# EasyEDA Pro project EPass_New.eprj

# Schematic Schematic1
Board Name: Board1
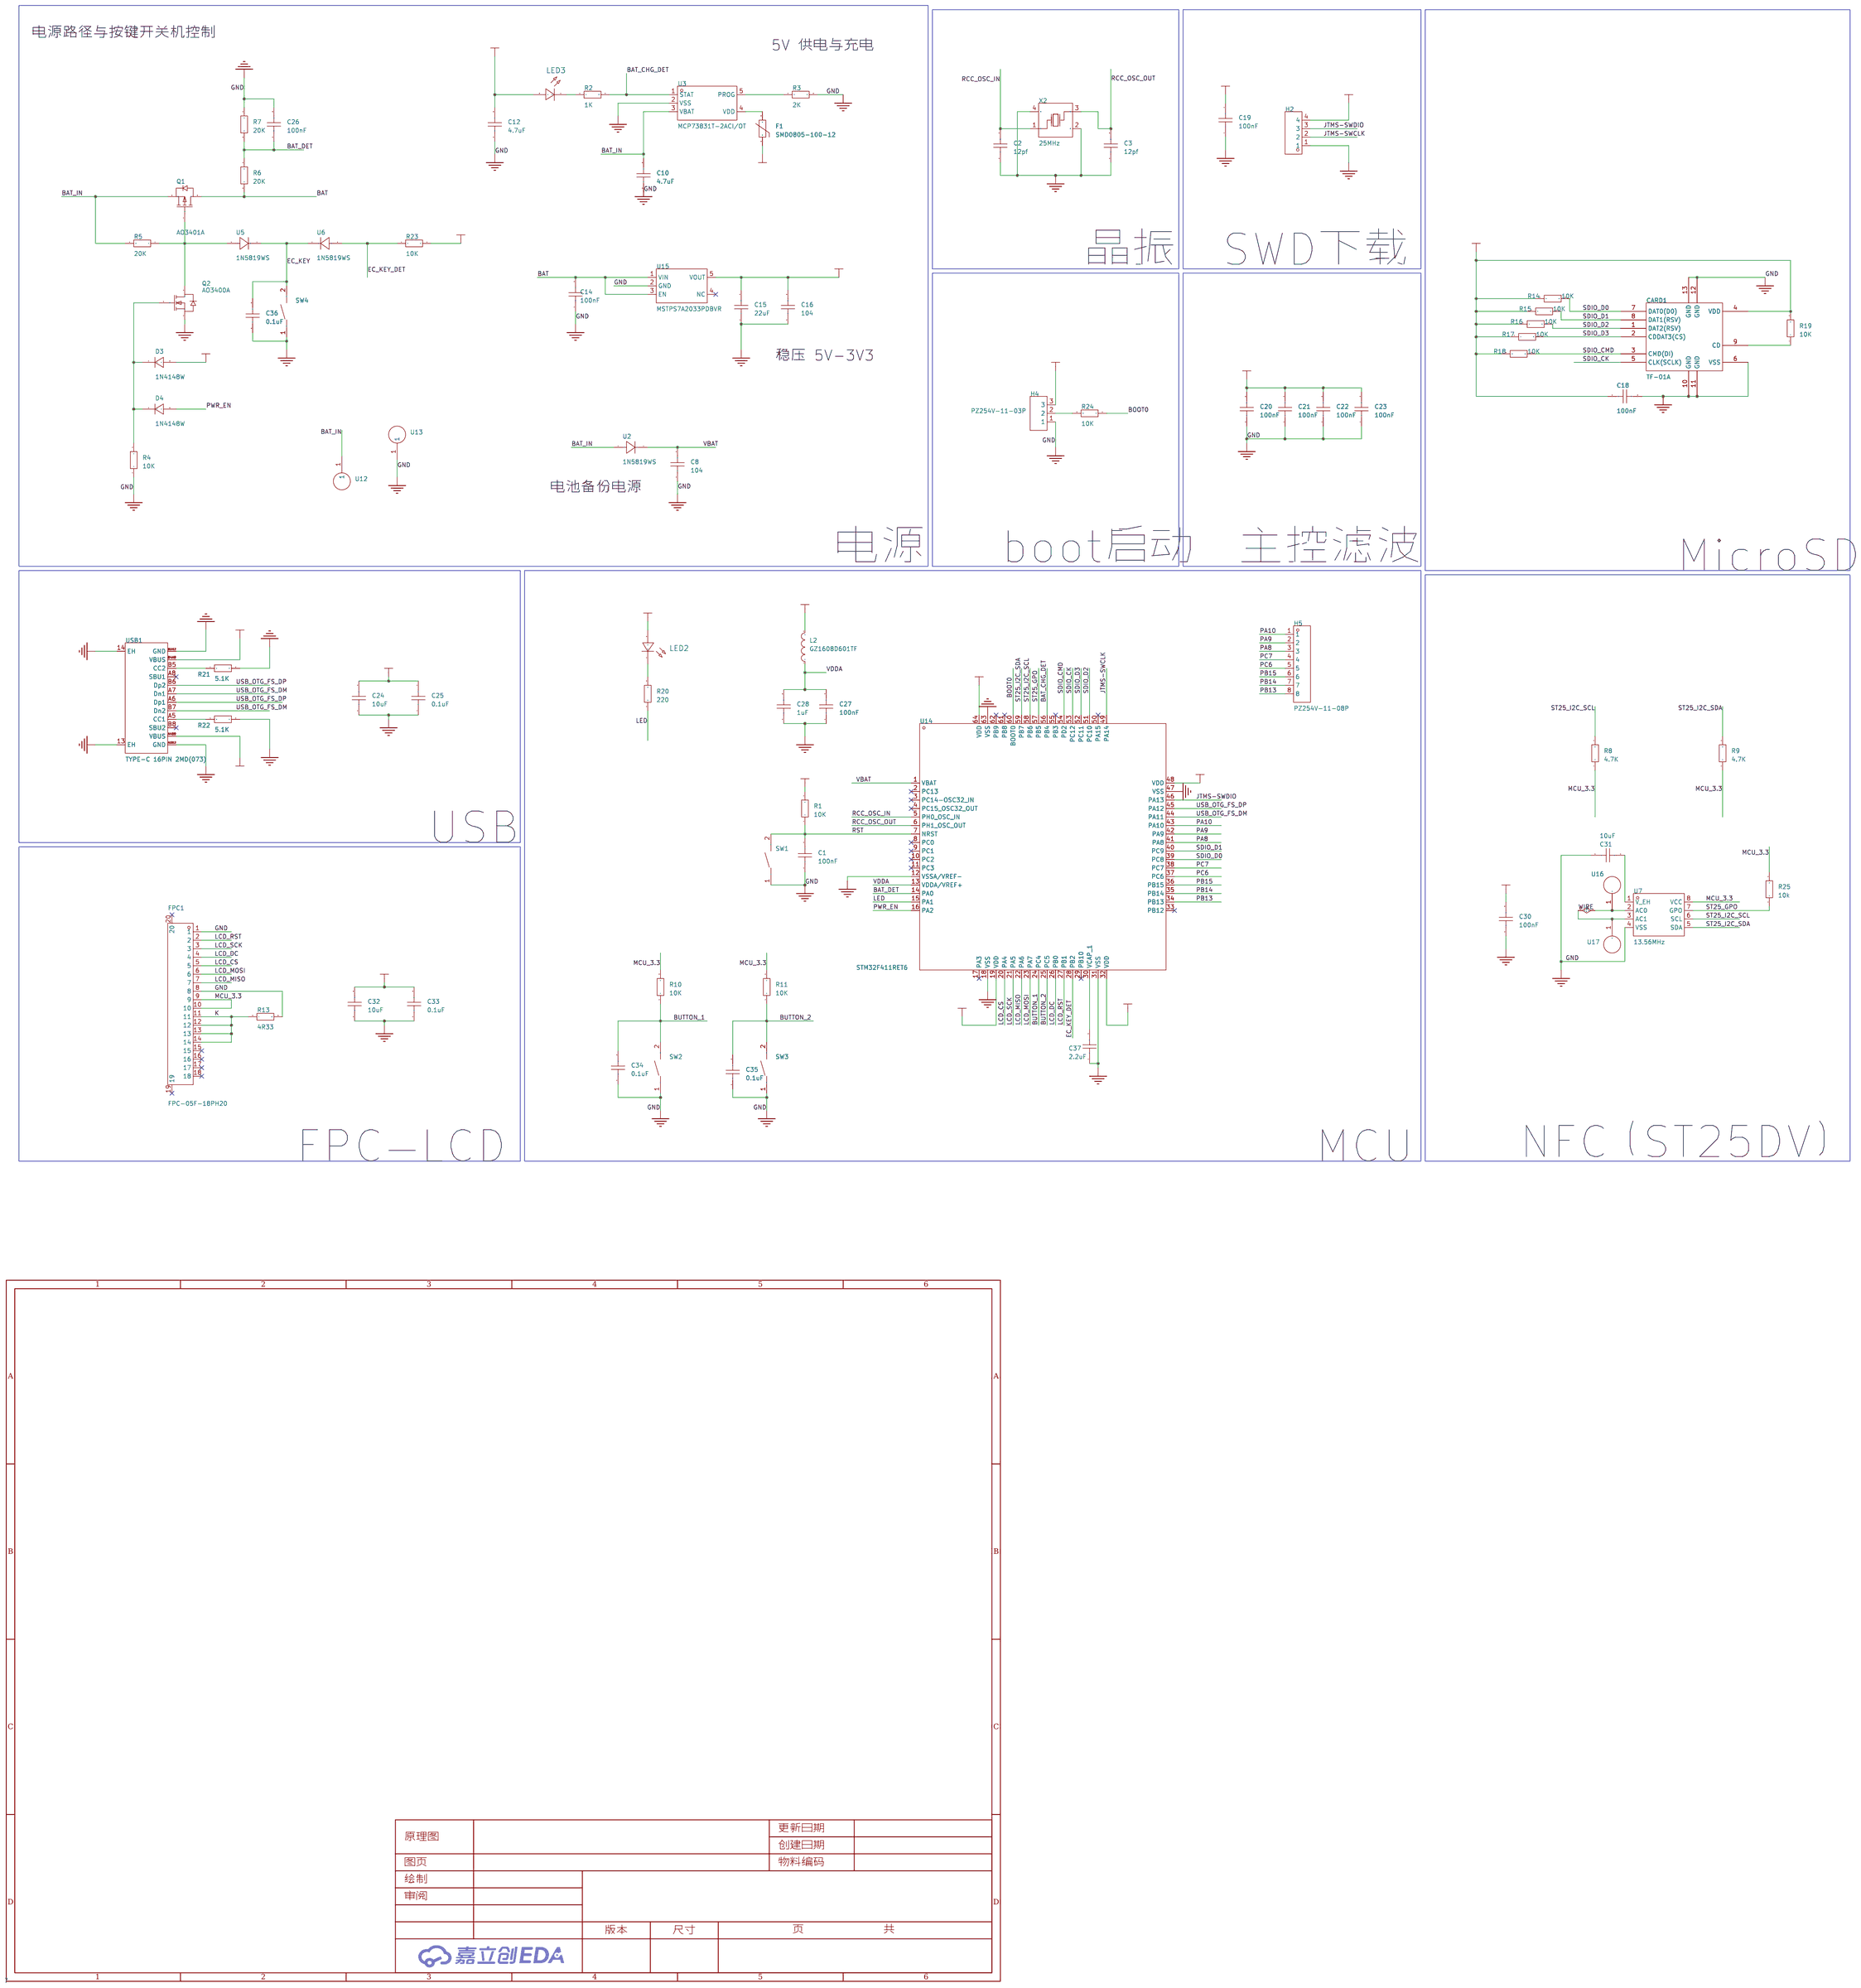
[diagram p0: schematic sheet]

## Parts
C1  100nF  [C0603]
C2  12pf  [C0603]
C3  12pf  [C0603]
C8  104  [C0603]
C10  4.7uF  [C0603]
C12  4.7uF  [C0603]
C14  100nF  [C0603]
C15  22uF  [C0603]
C16  104  [C0603]
C18  100nF  [C0603]
C19  100nF  [C0603]
C20  100nF  [C0603]
C21  100nF  [C0603]
C22  100nF  [C0603]
C23  100nF  [C0603]
C24  10uF  [C0603]
C25  0.1uF  [C0603]
C26  100nF  [C0603]
C27  100nF  [C0603]
C28  1uF  [C0603]
C30  100nF  [C0603]
C31  10uF  [C0603]
C32  10uF  [C0603]
C33  0.1uF  [C0603]
C34  0.1uF  [C0603]
C35  0.1uF  [C0603]
C36  0.1uF  [C0603]
C37  2.2uF  [C0603]
CARD1  TF-01A  [TF-SMD_TF-01A]
D3  1N4148W  [SOD-123_L2.7-W1.6-LS3.7-FD]
D4  1N4148W  [SOD-123_L2.7-W1.6-LS3.7-FD]
F1  SMD0805-100-12  [R0805]
FPC1  FPC-05F-18PH20  [FPC-SMD_18P-P0.50_FPC-05F-18PH20]
H2  PZ254V-11-04P  [HDR-TH_4P-P2.54-V-M]
H4  PZ254V-11-03P  [HDR-TH_3P-P2.54-V-M_PZ254V-11-03P]
H5  PZ254V-11-08P  [HDR-TH_8P-P2.54-V-M]
L2  GZ1608D601TF  [L0603]
LED2  -  [LED_0603]
LED3  -  [LED_0603]
Q1  AO3401A  [SOT-23_L2.9-W1.3-P1.90-LS2.4-BR]
Q2  AO3400A  [SOT-23-3_L2.9-W1.3-P1.90-LS2.4-BR]
R1  10K  [R0603]
R2  1K  [R0603]
R3  2K  [R0603]
R4  10K  [R0603]
R5  20K  [R0603]
R6  20K  [R0603]
R7  20K  [R0603]
R8  4.7K  [R0603]
R9  4.7K  [R0603]
R10  10K  [R0603]
R11  10K  [R0603]
R13  4R33  [R0603]
R14  10K  [R0603]
R15  10K  [R0603]
R16  10K  [R0603]
R17  10K  [R0603]
R18  10K  [R0603]
R19  10K  [R0603]
R20  220  [R0603]
R21  5.1K  [R0603]
R22  5.1K  [R0603]
R23  10K  [R0603]
R24  10K  [R0603]
R25  10k  [R0603]
SW1  TS-1088-AR02016  [SW-SMD_L3.9-W3.0-P4.45]
SW2  TS-1088-AR02016  [SW-SMD_L3.9-W3.0-P4.45]
SW3  TS-1088-AR02016  [SW-SMD_L3.9-W3.0-P4.45]
SW4  TS-1088-AR02016  [SW-SMD_L3.9-W3.0-P4.45]
U2  1N5819WS  [SOD-323_L1.8-W1.3-LS2.5-RD]
U3  MCP73831T-2ACI/OT  [SOT-23-5_L3.0-W1.7-P0.95-LS2.8-BL]
U5  1N5819WS  [SOD-323_L1.8-W1.3-LS2.5-RD]
U6  1N5819WS  [SOD-323_L1.8-W1.3-LS2.5-RD]
U7  13.56MHz  [SO-8_L4.9-W3.9-P1.27-LS5.9-BL]
U12  -  [焊盘]
U13  -  [焊盘]
U14  STM32F411RET6  [LQFP-64_L10.0-W10.0-P0.50-LS12.0-BL]
U15  MSTPS7A2033PDBVR  [SOT-23-5_L3.0-W1.7-P0.95-LS2.8-BL]
U16  1625854-3  [TESTPOINT-SMD_L1.6-W0.8]
U17  1625854-3  [TESTPOINT-SMD_L1.6-W0.8]
USB1  TYPE-C 16PIN 2MD(073)  [USB-C-SMD_TYPE-C-16PIN-2MD-073]
X2  25MHz  [CRYSTAL-SMD_4P-L3.2-W2.5-BL]

## Library data of the parts
C1-C3 C8 C10 C12 C14-C16 C18-C28 C30-C37 = CAP_0603: Supplier Footprint: 0603
CARD1 = TF-01A_C91145: 卡连接方式:自弹式;卡类型:MicroSD卡(TF卡);连接器类型:卡座;本体最大高度:1.85mm;工作温度:-;; LCSC Part Name: 自弹式 MicroSD卡(TF卡) 卡座; Supplier Part: C91145; Manufacturer: 韩国韩荣; Supplier Footprint: SMD; JLCPCB Part Class: 扩展库; Datasheet: https://item.szlcsc.com/datasheet/TF-01A/92334.html; Supplier: LCSC; Card Connection Mode: 自弹式; Card Type: MicroSD卡(TF卡); Connector Type: 卡座; Supplementary Features: 带定位柱; Height Above Board: 1.85mm
D3 D4 = 1N4148W_C7420318: 二极管配置:独立式;整流电流:150mA;直流反向耐压(Vr):100V;正向压降(Vf):1.25V@150mA;反向恢复时间(Trr):4ns;; LCSC Part Name: 100V 150mA; Supplier Part: C7420318; Manufacturer: R+O(宏嘉诚); Supplier Footprint: SOD-123; JLCPCB Part Class: Extended Part; Datasheet: https://item.szlcsc.com/datasheet/1N4148W/8397140.html; Supplier: LCSC; Diode Configuration: 独立式; Pd - Power Dissipation: 400mW; Current - Rectified: 150mA; Voltage - DC Reverse(Vr): 100V; Voltage - Forward(Vf@If): 1.25V@150mA; Non-Repetitive Peak Forward Surge Current: 2A; Reverse Leakage Current (Ir): 1uA@75V; Reverse Recovery Time (trr): 4ns; Operating Junction Temperature Range: -55℃~+150℃
F1 = SMD0805-100-12: LCSC Part Name: 12V 1A; Supplier Part: C46640991; Manufacturer: R+O(宏嘉诚); Supplier Footprint: 0805; JLCPCB Part Class: 扩展库; Datasheet: https://item.szlcsc.com/datasheet/SMD0805-100-12/48798697.html; Supplier: LCSC; Voltage - Max: 12V; Current - Max: 40A; Hold Current: 1A; Trip Current: 2A; Power Dissipation: 600mW; Resistance - Initial (Ri) (Min): 40mΩ; Resistance - Post Trip (R1) (Max): 270mΩ; Time to Trip(Max): 300ms; Operating Temperature: -40℃~+85℃; Length: 2.2mm; Width: 1.5mm
FPC1 = FPC-05F-18PH20: 锁定特性:翻盖式;触点类型:卧贴;触点数量:18P;间距:0.5mm;安装方式:下接;工作温度:-25℃~+85℃;; LCSC Part Name: 翻盖式 卧贴 P数:18P 间距:0.5mm; Supplier Part: C2856802; Manufacturer: XUNPU(讯普); Supplier Footprint: SMD,P=0.5mm,卧贴; JLCPCB Part Class: 扩展库; Datasheet: https://item.szlcsc.com/datasheet/FPC-05F-18PH20/3056900.html; Supplier: LCSC; Locking Feature: 翻盖式; Contact Type: 卧贴; Number of Contacts: 18P; Pitch: 0.5mm; Mounting Type: 下接; FFC, FCB Thickness: 0.3mm; Height Above Board: 2mm; Contact Material: 磷青铜; Contact Plating: 锡; Operating Temperature: -25℃~+85℃; Rated Voltage (Max): 50V; Current Rating (Max): 500mA
H2 = PZ254V-11-04P: 插针结构:1x4P;间距:2.54mm;行距:-;圆针/方针:方针;安装方式:直插;排数:单排;总PIN位数:4P;额定电流:3A;额定电压:250V;配合针长度:6mm;塑高:2.5mm;端接针长度:3mm;触头材质:-;工作温度:-40℃~+105℃;颜色:黑色;; LCSC Part Name: 1x4P 间距:2.54mm 方针 直插; Supplier Part: C2691448; Manufacturer: XFCN(兴飞); Supplier Footprint: 插件,P=2.54mm; JLCPCB Part Class: 扩展库; Datasheet: https://item.szlcsc.com/datasheet/PZ254V-11-04P/2801085.html; Supplier: LCSC; Pin Structure: 1x4P; Pitch: 2.54mm; Circluar Pins/Square Pins: 方针; Mounting Type: 直插; Number of Rows: 单排; Number of Pins: 4P; Current Rating: 3A; Voltage Rating (Max): 250V; Length of Mating Pin: 6mm; Insulation Height: 2.5mm; Length of End Connection Pin: 3mm; Operating Temperature: -40℃~+105℃; Color: 黑色
H4 = PZ254V-11-03P: 插针结构:1x3P;间距:2.54mm;行距:-;圆针/方针:方针;安装方式:直插;排数:单排;总PIN位数:3P;额定电流:3A;额定电压:250V;配合针长度:6mm;塑高:2.5mm;端接针长度:3mm;工作温度:-40℃~+105℃;颜色:黑色;; LCSC Part Name: 1x3P 间距:2.54mm 方针 直插; Supplier Part: C2937625; Manufacturer: XFCN(兴飞); Supplier Footprint: 插件,P=2.54mm; JLCPCB Part Class: 扩展库; Datasheet: https://item.szlcsc.com/datasheet/PZ254V-11-03P/3293280.html; Supplier: LCSC; Pin Structure: 1x3P; Pitch: 2.54mm; Circluar Pins/Square Pins: 方针; Mounting Type: 直插; Number of Rows: 单排; Number of Pins: 3P; Current Rating: 3A; Voltage Rating (Max): 250V; Length of Mating Pin: 6mm; Insulation Height: 2.5mm; Length of End Connection Pin: 3mm; Operating Temperature: -40℃~+105℃; Color: 黑色
H5 = PZ254V-11-08P: LCSC Part Name: 1x8P 间距:2.54mm 方针 直插; Supplier Part: C492407; Manufacturer: XFCN(兴飞); Supplier Footprint: 插件,P=2.54mm; JLCPCB Part Class: 扩展库; Datasheet: https://item.szlcsc.com/datasheet/PZ254V-11-08P/502963.html; Supplier: LCSC; Pin Structure: 1x8P; Pitch: 2.54mm; Circluar Pins/Square Pins: 方针; Mounting Type: 直插; Number of Rows: 单排; Number of Pins: 8P; Current Rating: 3A; Voltage Rating (Max): 250V; Length of Mating Pin: 6mm; Insulation Height: 2.5mm; Length of End Connection Pin: 3mm; Contact Material: 黄铜; Operating Temperature: -40℃~+105℃; Color: 黑色
L2 = GZ1608D601TF: LCSC Part Name: 单路 0603磁珠 阻抗600Ω@100MHz; Supplier Part: C1002; Manufacturer: Sunlord(顺络); Supplier Footprint: 0603; JLCPCB Part Class: 基础库; Datasheet: https://item.szlcsc.com/datasheet/GZ1608D601TF/1354.html; Supplier: LCSC; Impedance @ Frequency: 600Ω@100MHz; Tolerance: ±25%; DC Resistance(DCR): 450mΩ; Current Rating: 200mA; Number of Circuits: 1; Operating Temperature: -55℃~+125℃
LED2 LED3 = LED_0603-R: Supplier Footprint: 0603
Q1 = AO3401A_C15127: 数量:1个P沟道;漏源电压(Vdss):30V;连续漏极电流(Id):4A;导通电阻(RDS(on)):47mΩ@10V；85mΩ@2.5V；60mΩ@4.5V;耗散功率(Pd):-;阈值电压(Vgs(th)):900mV;; LCSC Part Name: 1个P沟道 耐压:30V 电流:4A; Supplier Part: C15127; Manufacturer: AOS; Supplier Footprint: SOT-23; JLCPCB Part Class: 基础库; Datasheet: https://item.szlcsc.com/datasheet/AO3401A/15801.html; Supplier: LCSC; Number: 1个P沟道; Drain to Source Voltage: 30V; Current - Continuous Drain(Id): 4A; RDS(on): 47mΩ@10V；85mΩ@2.5V；60mΩ@4.5V; Gate Threshold Voltage (Vgs(th)): 900mV; Gate Charge(Qg): 14nC@10V; Input Capacitance(Ciss): 645pF; Reverse Transfer Capacitance (Crss@Vds): 55pF; Output Capacitance(Coss): 80pF
Q2 = AO3400A_C20917: 数量:-;漏源电压(Vdss):30V;连续漏极电流(Id):-;导通电阻(RDS(on)):48mΩ@2.5V;耗散功率(Pd):-;阈值电压(Vgs(th)):1.45V@250uA;; LCSC Part Name: 1个N沟道 耐压:30V 电流:5.7A; Supplier Part: C20917; Manufacturer: AOS; Supplier Footprint: SOT-23-3L; JLCPCB Part Class: 基础库; Datasheet: https://item.szlcsc.com/datasheet/AO3400A/21629.html; Supplier: LCSC; Drain to Source Voltage: 30V; RDS(on): 48mΩ@2.5V; Gate Threshold Voltage (Vgs(th)): 1.45V@250uA; Gate Charge(Qg): 7nC@10V; Input Capacitance(Ciss): 630pF@15V; Operating Temperature: -55℃~+150℃@(Tj); Type: N沟道
R1-R11 R13-R25 = Res_0603: Supplier Footprint: 0603
SW1-SW4 = TS-1088-AR02016: 电路结构:单刀单掷;按钮形状:圆形按钮;作用力:1.6N;安装方式:立贴;开关长度:4mm;开关宽度:3mm;开关高度:2mm;带支架:不带支架;触点电流:50mA;额定电压:12V;工作寿命:10万次;; LCSC Part Name: 4*3*2mm 立贴 轻触开关; Supplier Part: C720477; Manufacturer: XUNPU(讯普); Supplier Footprint: SMD,4x3mm; JLCPCB Part Class: 基础库; Datasheet: https://item.szlcsc.com/datasheet/TS-1088-AR02016/763484.html; Supplier: LCSC; Circuit: 单刀单掷; Actuator Style: 圆形按钮; Operating Force: 1.6N; Mounting Type: 立贴; Length: 4mm; Width: 3mm; Switch Height: 2mm; with Bracket: 不带支架; Contact Current: 50mA; Voltage Rating: 12V; Actuator/Cap Color: 黑色; Termination Style: SMD接片; Life: 10万次; Operating Temperature: -30℃~+80℃
U2 U5 U6 = 1N5819WS_C191023: 正向压降(Vf):600mV@1A;直流反向耐压(Vr):40V;整流电流:1A;; LCSC Part Name: 电压:40V 电流:1A; Supplier Part: C191023; Manufacturer: Hottech(合科泰); Supplier Footprint: SOD-323; JLCPCB Part Class: Basic Part; Datasheet: https://item.szlcsc.com/datasheet/1N5819WS/213850.html; Supplier: LCSC; Voltage - Forward(Vf@If): 600mV@1A; Voltage - DC Reverse(Vr): 40V; Current - Rectified: 1A; Non-Repetitive Peak Forward Surge Current: 25A; Reverse Leakage Current (Ir): 500uA@40V
U3 = MCP73831T-2ACI/OT: 工作电压:3.75V~6V;最大充电电流:550mA;电池类型:锂电池;电池节数:1;; LCSC Part Name: 单节锂离子/锂聚合物充电管理控制器; Supplier Part: C424093; Manufacturer: MICROCHIP(美国微芯); Supplier Footprint: SOT-23-5; JLCPCB Part Class: 扩展库; Datasheet: https://item.szlcsc.com/datasheet/MCP73831T-2ACI%252FOT/417116.html; Supplier: LCSC; The Chip Type: 充电芯片; Voltage - Supply: 3.75V~6V; Charge Current - Max: 550mA; Charging Saturation Voltage: 4.2V; Type of Battery: 锂电池; Number of Cells: 1; Operating Temperature: -40℃~+85℃; Battery Temperature Detection: 不支持; Supply Current (Iq): 53uA
U7 = ST25DV04KC-IE6S3: 协议:ISO 15693,NFC;接口类型:I2C;传输速率:53Kbit/s;; LCSC Part Name: 动态NFC/RFID标签IC，带EEPROM、快速传输模式和优化I2C接口; Supplier Part: C3304276; Manufacturer: ST(意法半导体); Supplier Footprint: SO-8; JLCPCB Part Class: 扩展库; Datasheet: https://item.szlcsc.com/datasheet/ST25DV04KC-IE6S3/3868865.html; Supplier: LCSC; agreement: ISO 15693,NFC; Interface: I2C; transmission rate: 53Kbit/s; Voltage - Supply: 1.8V~5.5V
U12 U13 = 焊盘
U14 = STM32F411RET6: CPU内核:ARM Cortex-M4;CPU最大主频:100MHz;CPU位数:32 Bit;; LCSC Part Name: 带DSP和FPU的高性能基本型系列ARM Cortex-M4 MCU，具有512 KB Flash、100 MHz CPU和ART加速器; Supplier Part: C94355; Manufacturer: ST(意法半导体); Supplier Footprint: LQFP-64(10x10); JLCPCB Part Class: 扩展库; Datasheet: https://item.szlcsc.com/datasheet/STM32F411RET6/95553.html; Supplier: LCSC; CPU Core: ARM Cortex-M4; CPU Maximum Speed: 100MHz; Core Size: 32 Bit; Program Storage Size: 512KB; Program Memory Type: FLASH; RAM Size: 128KB; Number of I/O: 50; ADC (Bit): 12bit; Oscillator Type: 内置; Voltage - Supply: 1.7V~3.6V; Operating Temperature: -40℃~+85℃
U15 = MSTPS7A2033PDBVR: LCSC Part Name: 3.3V 400mA 10V; Supplier Part: C45367201; Manufacturer: MSKSEMI(美森科); Supplier Footprint: SOT-23-5; JLCPCB Part Class: 扩展库; Datasheet: https://item.szlcsc.com/datasheet/MSTPS7A2033PDBVR/47461081.html; Supplier: LCSC; Voltage - Supply: 10V; Output Voltage: 3.3V; Output Current: 400mA; Power Supply Rejection Ratio (PSRR): 76dB@(1kHz); Voltage Dropout: 75mV@(50mA); standby current: 2uA; Noise: 70uVrms; Features: 短路保护；使能控制；过流保护；热关断; Operating Temperature: -40℃~+85℃; Number of Outputs: 1
U16 U17 = 1625854-3: LCSC Part Name: 探头焊盘; Supplier Part: C5379041; Manufacturer: TE Connectivity(泰科电子); Supplier Footprint: 0603; JLCPCB Part Class: 扩展库; Datasheet: https://item.szlcsc.com/datasheet/1625854-3/6243042.html; Supplier: LCSC; Connector Type: 铁环型(贴片); Plastic Color: 无塑胶; Board Space (Diameter φ/ Length x Width): 1.6mmx0.8mm
USB1 = TYPE-C 16PIN 2MD(073): 连接器类型:Type-C;协议标准:-;公母:母;安装方式:卧贴;触点数量:16P;端口数量:1;额定电流 - 电源:3A;工作温度:-25℃~+85℃;; LCSC Part Name: Type-C 母 卧贴; Supplier Part: C2765186; Manufacturer: SHOU HAN(首韩); Supplier Footprint: SMD; JLCPCB Part Class: 扩展库; Datasheet: https://item.szlcsc.com/datasheet/TYPE-C%252016PIN%25202MD(073)/2901843.html; Supplier: LCSC; Connector Type: Type-C; Gender: 母; Mounting Type: 卧贴; Number of Contacts: 16P; Number of Ports: 1; Current Rating-Power: 3A; Voltage Rating: 5V; Connect-Disconnect Life: 1万次; Detection color: 黑色; Operating Temperature: -25℃~+85℃
X2 = X322525MOB4SI: LCSC Part Name: YSX321SL 25MHZ 4P 3225 12PF ±10PPM -40~85℃ (±20PPM); Supplier Part: C9006; Manufacturer: YXC(扬兴晶振); Supplier Footprint: SMD3225-4P; JLCPCB Part Class: 基础库; Datasheet: https://item.szlcsc.com/datasheet/X322525MOB4SI/9526.html; Supplier: LCSC; Type: 贴片晶振; Normal temperature Frequency Tolerance: ±10ppm; Load Capacitance: 12pF; Frequency Stability: ±20ppm; Operating Temperature: -40℃~+85℃

## Nets
+5V: C12.2 C24.2 C25.2 D3.2(A) F1.1 LED3.2(A) USB1.A4B9(VBUS) USB1.B4A9(VBUS)
GND: C1.1 C2.1 C3.1 C8.1 C10.1 C12.1 C14.1 C15.1 C16.1 C18.2 C19.1 C20.1 C21.1 C22.1 C23.1 C24.1 C25.1 C26.2 C27.1 C28.1 C30.1 C31.2 C32.1 C33.1 C34.1 C35.1 C36.1 C37.1 CARD1.6(VSS) CARD1.10(GND) CARD1.11(GND) CARD1.12(GND) CARD1.13(GND) FPC1.1 FPC1.8 H2.1 H4.1 Q2.2(S) R3.2 R4.1 R7.1 R13.2 R21.2 R22.2 SW1.1 SW2.1 SW3.1 SW4.1 U3.2(VSS) U7.4(VSS) U13.1 U14.12(VSSA/VREF-) U14.18(VSS) U14.31(VSS) U14.47(VSS) U14.63(VSS) U15.2(GND) USB1.13(EH) USB1.14(EH) USB1.A1B12(GND) USB1.B1A12(GND) X2.2(GND) X2.4(GND)
VBAT: C8.2 U2.1(K) U14.1(VBAT)
VDDA: C27.2 C28.2 L2.1 U14.13(VDDA/VREF+)
BAT: C14.2 Q1.3(D) R6.2 U15.1(VIN) U15.3(EN)
BAT_CHG_DET: R2.2 U3.1(STAT) U14.56(PB4)
BAT_DET: C26.1 R6.1 R7.2 U14.14(PA0)
BAT_IN: C10.2 Q1.2(S) R5.2 U2.2(A) U3.3(VBAT) U12.1
BOOT0: R24.1 U14.60(BOOT0)
BUTTON_1: C34.2 R10.1 SW2.2 U14.24(PC4)
BUTTON_2: C35.2 R11.1 SW3.2 U14.25(PC5)
EC_KEY: C36.2 SW4.2 U5.1(K) U6.1(K)
EC_KEY_DET: R23.1 U6.2(A) U14.28(PB2)
JTMS-SWCLK: H2.2 U14.49(PA14)
JTMS-SWDIO: H2.3 U14.46(PA13)
K: FPC1.11 FPC1.12 FPC1.13 FPC1.14 R13.1
LCD_CS: FPC1.5 U14.20(PA4)
LCD_DC: FPC1.4 U14.26(PB0)
LCD_MISO: FPC1.7 U14.22(PA6)
LCD_MOSI: FPC1.6 U14.23(PA7)
LCD_RST: FPC1.2 U14.27(PB1)
LCD_SCK: FPC1.3 U14.21(PA5)
LED: R20.1 U14.15(PA1)
MCU_3.3: C15.2 C16.2 C18.1 C19.2 C20.2 C21.2 C22.2 C23.2 C30.2 C32.2 C33.2 CARD1.4(VDD) FPC1.9 FPC1.10 H2.4 H4.3 L2.2 LED2.2(A) R1.2 R8.1 R9.1 R10.2 R11.2 R14.1 R15.1 R16.1 R17.1 R18.1 R19.2 R23.2 R25.2 U7.8(VCC) U14.19(VDD) U14.32(VDD) U14.48(VDD) U14.64(VDD) U15.5(VOUT)
PA8: H5.3 U14.41(PA8)
PA9: H5.2 U14.42(PA9)
PA10: H5.1 U14.43(PA10)
PB13: H5.8 U14.34(PB13)
PB14: H5.7 U14.35(PB14)
PB15: H5.6 U14.36(PB15)
PC6: H5.5 U14.37(PC6)
PC7: H5.4 U14.38(PC7)
PWR_EN: D4.2(A) U14.16(PA2)
RCC_OSC_IN: C2.2 U14.5(PH0_OSC_IN) X2.1(OSC1)
RCC_OSC_OUT: C3.2 U14.6(PH1_OSC_OUT) X2.3(OSC2)
RST: C1.2 R1.1 SW1.2 U14.7(NRST)
SDIO_CK: CARD1.5(CLK(SCLK)) U14.53(PC12)
SDIO_CMD: CARD1.3(CMD(DI)) R18.2 U14.54(PD2)
SDIO_D0: CARD1.7(DAT0(D0)) R14.2 U14.39(PC8)
SDIO_D1: CARD1.8(DAT1(RSV)) R15.2 U14.40(PC9)
SDIO_D2: CARD1.1(DAT2(RSV)) R16.2 U14.51(PC10)
SDIO_D3: CARD1.2(CDDAT3(CS)) R17.2 U14.52(PC11)
ST25_GPO: R25.1 U7.7(GPO) U14.57(PB5)
ST25_I2C_SCL: R8.2 U7.6(SCL) U14.58(PB6)
ST25_I2C_SDA: R9.2 U7.5(SDA) U14.59(PB7)
USB_OTG_FS_DM: U14.44(PA11) USB1.A7(Dn1) USB1.B7(Dn2)
USB_OTG_FS_DP: U14.45(PA12) USB1.A6(Dp1) USB1.B6(Dp2)
WIRE: U7.2(AC0) U7.3(AC1) U16.1 U17.1
$1N1186: LED3.1(C) R2.1
$1N1187: R3.1 U3.5(PROG)
$1N1206: F1.2 U3.4(VDD)
$1N1217: D3.1(C) D4.1(C) Q2.1(G) R4.2
$1N1218: Q1.1(G) Q2.3(D) R5.1 U5.2(A)
$1N1953: R21.1 USB1.B5(CC2)
$1N1965: R22.1 USB1.A5(CC1)
$1N4078: LED2.1(C) R20.2
$1N4684: H4.2 R24.2
$1N7160: CARD1.9(CD) R19.1
$1N7661: C31.1 U7.1(V_EH)
$1N12645: C37.2 U14.30(VCAP_1)

Not connected (* = marked no-connect by the designer): FPC1 15* 16* 17* 18* 19* 20*; U14 2(PC13)* 3(PC14-OSC32_IN)* 4(PC15_OSC32_OUT)* 8(PC0)* 9(PC1)* 10(PC2)* 11(PC3)* 17(PA3)* 29(PB10)* 33(PB12)* 50(PA15)* 55(PB3)* 61(PB8)* 62(PB9)*; U15 4(NC)*; USB1 A8(SBU1)* B8(SBU2)*

## Notes on the sheet
- 电源路径与按键开关机控制
- 5V 供电与充电
- 晶振
- SWD下载
- 稳压 5V-3V3
- 电池备份电源
- 电源
- boot启动
- 主控滤波
- MicroSD
- USB
- NFC（ST25DV）
- FPC—LCD
- MCU

# Board PCB1
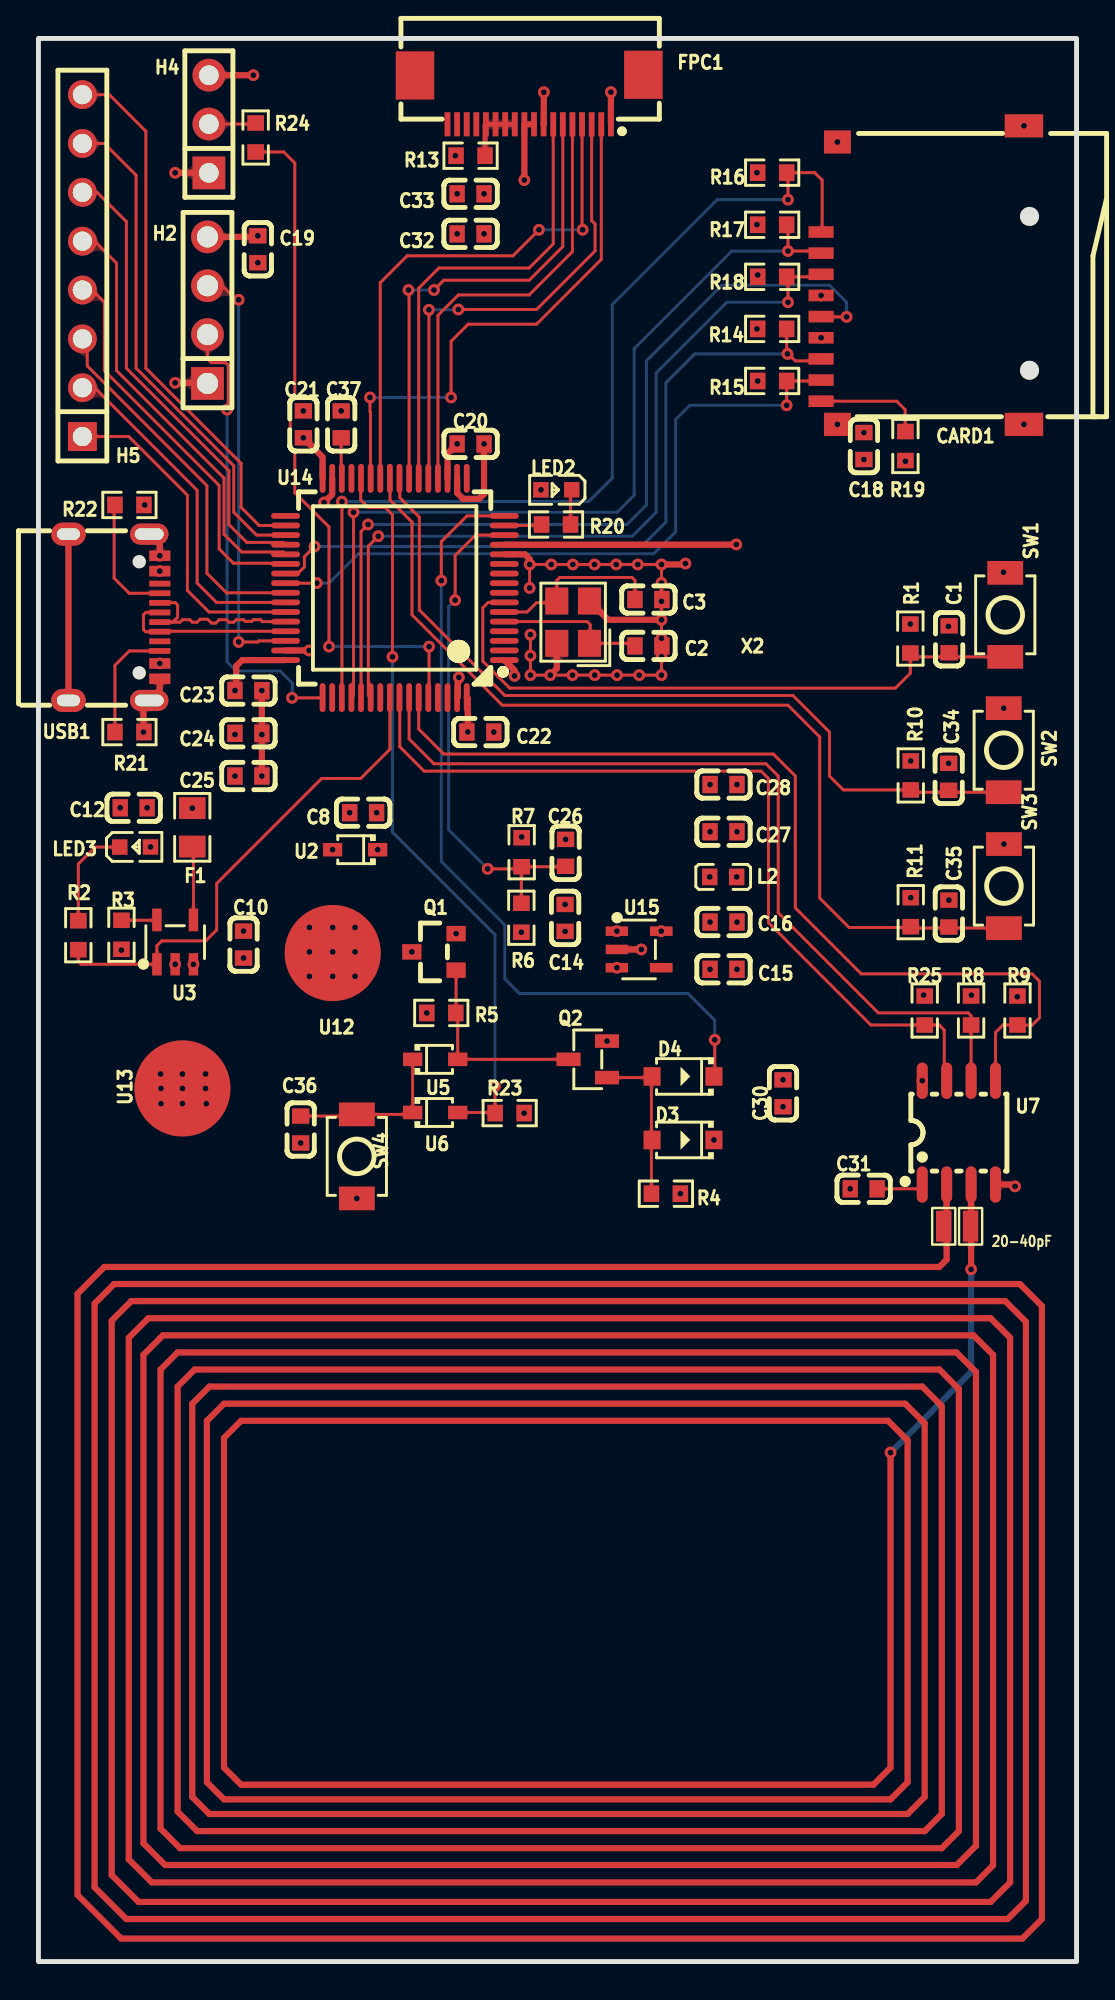
[diagram p1: board, top side]
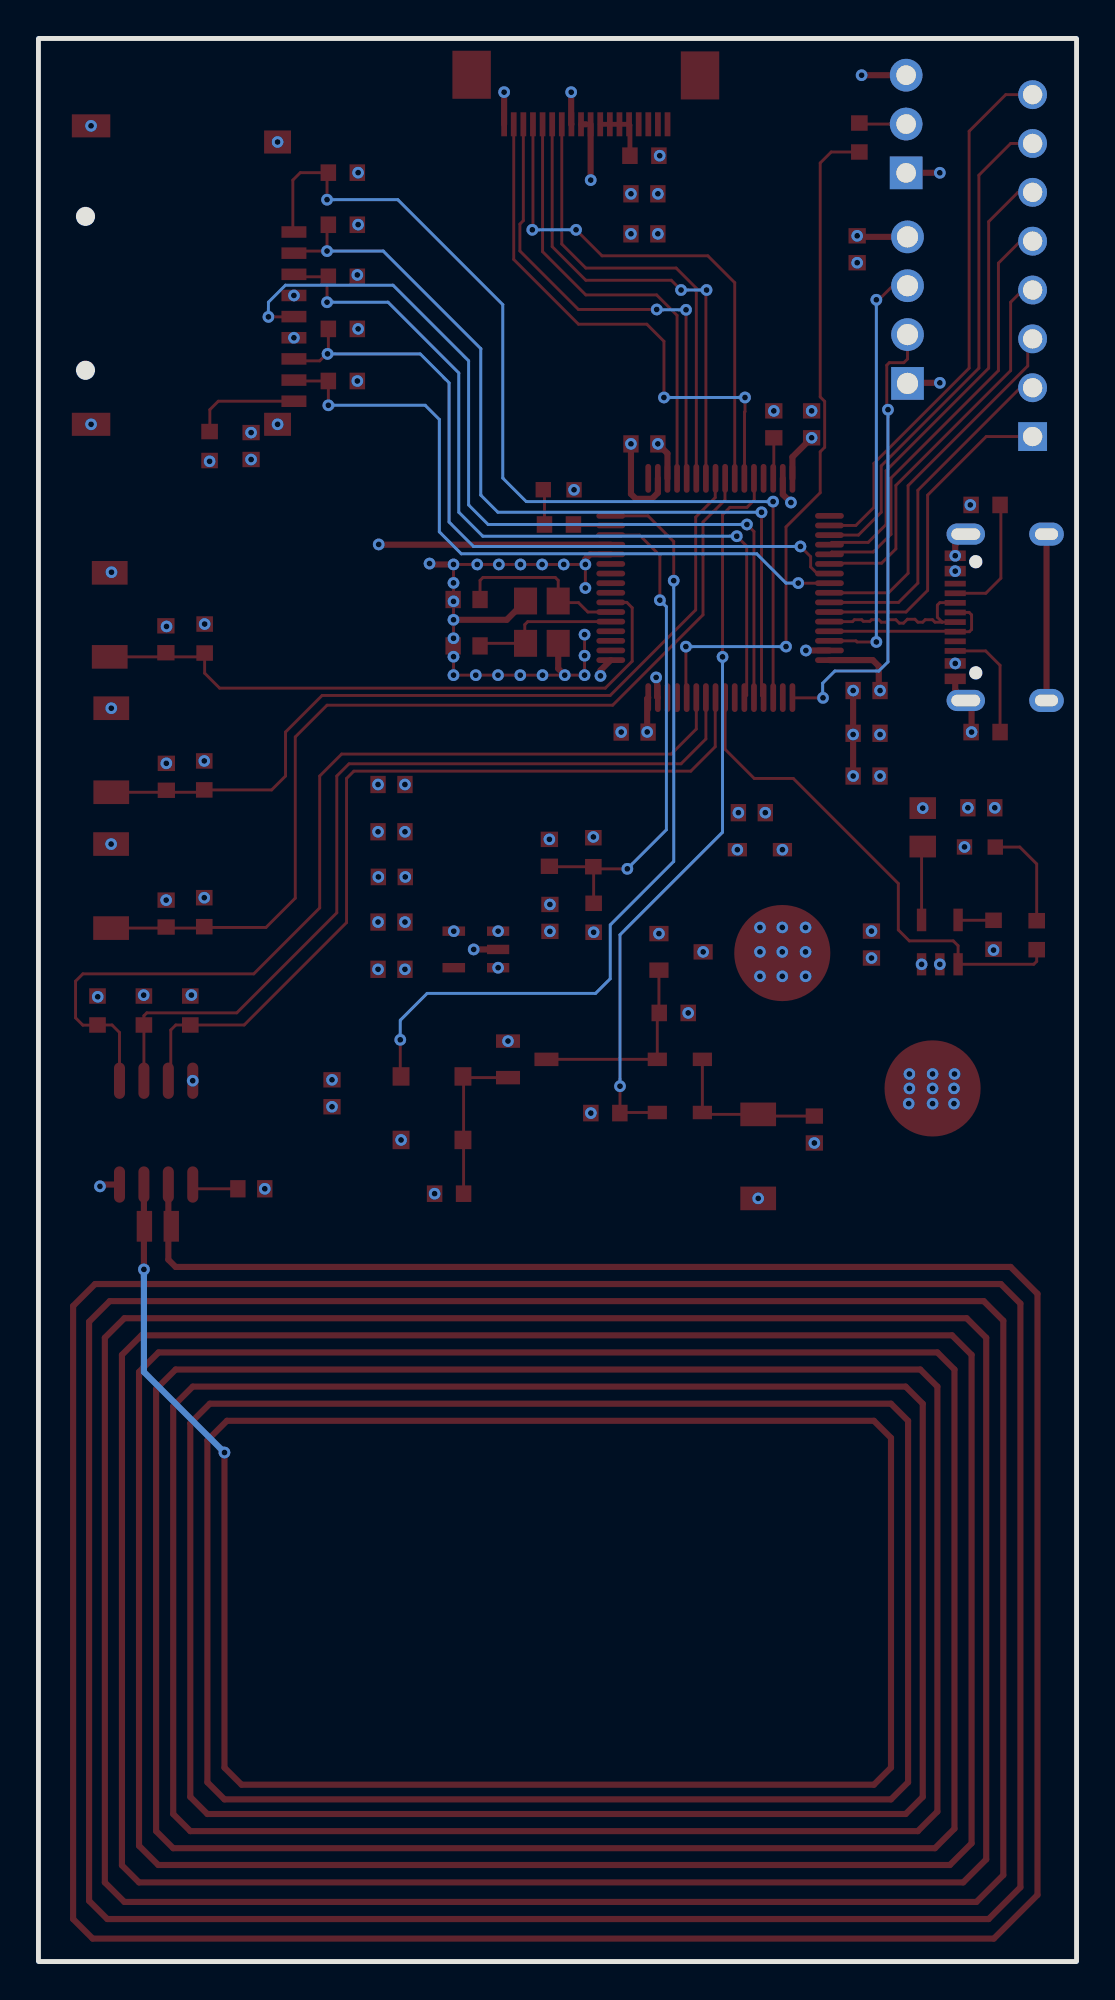
[diagram p2: board, bottom side, seen from below]

Outline 54 x 100 mm; copper layers: Top Layer, Inner1, Inner2, Bottom Layer. Coordinates in mm from the lower left corner of the outline.
Outline path: rectangle 0,100 54,0
Stack: Top Layer 0.035mm 外层铜厚1oz / Dielectric1 0.2104mm 7628 RC49% 8.6mil / Inner1 0.0152mm 内层铜厚 / Dielectric2 1.065mm 1.1mm H/HOZ Copper / Inner2 0.0152mm 内层铜厚 / Dielectric3 0.2104mm 7628 RC49% 8.6mil / Bottom Layer 0.035mm 外层铜厚1oz

## Design rules (mm)
net USB_OTG_FS_DM: DP1
net USB_OTG_FS_DP: DP1
template: 自定义配置
spacing copperThickness1oz (default): track to track 0.102, other pairs 0.152 to 0.3
spacing copperThickness2oz: track to track 0.203, other pairs 0.152 to 0.3
track width copperThickness1oz (default): min 0.127, default 0.152, max 2.54
track width copperThickness2oz: min 0.203, default 0.254, max 2.54
differential pair differentialPair (default): width min 0.127, default 0.152, max 2.54; gap min 0.102, default 0.102
via viaSize (default): diameter min 0.5, default 0.61, max 10; hole min 0.3, default 0.305, max 6.299

## Placement (name value [footprint] x y rotation side)
C1  100nF  [C0603]  47.37 68.76 270 top
C2  12pf  [C0603]  31.73 68.41 180 top
C3  12pf  [C0603]  31.73 70.83 180 top
C8  104  [C0603]  16.89 59.74 0 top
C10  4.7uF  [C0603]  10.67 52.88 270 top
C12  4.7uF  [C0603]  4.95 60 0 top
C14  100nF  [C0603]  27.4 54.27 270 top
C15  22uF  [C0603]  35.64 51.6 180 top
C16  104  [C0603]  35.64 54.05 180 top
C18  100nF  [C0603]  42.94 78.81 90 top
C19  100nF  [C0603]  11.41 89.04 90 top
C20  100nF  [C0603]  22.48 78.92 180 top
C21  100nF  [C0603]  13.78 79.93 270 top
C22  100nF  [C0603]  22.99 63.93 180 top
C23  100nF  [C0603]  10.92 66.09 180 top
C24  10uF  [C0603]  10.92 63.87 180 top
C25  0.1uF  [C0603]  10.92 61.65 180 top
C26  100nF  [C0603]  27.42 57.65 90 top
C27  100nF  [C0603]  35.64 58.75 0 top
C28  1uF  [C0603]  35.64 61.2 0 top
C30  100nF  [C0603]  38.73 45.15 270 top
C31  10uF  [C0603]  42.93 40.18 180 top
C32  10uF  [C0603]  22.48 89.84 0 top
C33  0.1uF  [C0603]  22.48 91.92 0 top
C34  0.1uF  [C0603]  47.35 61.61 270 top
C35  0.1uF  [C0603]  47.36 54.49 270 top
C36  0.1uF  [C0603]  13.64 43.27 90 top
C37  2.2uF  [C0603]  15.75 79.93 270 top
CARD1  TF-01A  [TF-SMD_TF-01A]  45.99 87.7 90 top
D3  1N4148W  [SOD-123_L2.7-W1.6-LS3.7-FD]  33.53 42.72 0 top
D4  1N4148W  [SOD-123_L2.7-W1.6-LS3.7-FD]  33.53 46.03 0 top
F1  SMD0805-100-12  [R0805]  8 58.98 270 top
FPC1  FPC-05F-18PH20  [FPC-SMD_18P-P0.50_FPC-05F-18PH20]  25.53 96.83 180 top
H2  PZ254V-11-04P  [HDR-TH_4P-P2.54-V-M]  8.79 85.87 90 top
H4  PZ254V-11-03P  [HDR-TH_3P-P2.54-V-M_PZ254V-11-03P]  8.87 95.55 90 top
H5  PZ254V-11-08P  [HDR-TH_8P-P2.54-V-M]  2.29 88.19 90 top
L2  GZ1608D601TF  [L0603]  35.62 56.4 180 top
LED2  -  [LED_0603]  26.89 76.53 180 top
LED3  -  [LED_0603]  5.08 57.96 0 top
Q1  AO3401A  [SOT-23_L2.9-W1.3-P1.90-LS2.4-BR]  20.57 52.5 0 top
Q2  AO3400A  [SOT-23-3_L2.9-W1.3-P1.90-LS2.4-BR]  28.57 46.91 0 top
R1  10K  [R0603]  45.35 68.8 90 top
R2  1K  [R0603]  2.07 53.37 270 top
R3  2K  [R0603]  4.32 53.39 270 top
R4  10K  [R0603]  32.64 39.93 180 top
R5  20K  [R0603]  20.96 49.33 180 top
R6  20K  [R0603]  25.12 54.28 270 top
R7  20K  [R0603]  25.14 57.68 270 top
R8  4.7K  [R0603]  48.51 49.45 270 top
R9  4.7K  [R0603]  50.93 49.45 270 top
R10  10K  [R0603]  45.38 61.68 90 top
R11  10K  [R0603]  45.38 54.57 90 top
R13  4R33  [R0603]  22.48 93.9 180 top
R14  10K  [R0603]  38.17 84.9 0 top
R15  10K  [R0603]  38.17 82.19 0 top
R16  10K  [R0603]  38.17 93.02 0 top
R17  10K  [R0603]  38.17 90.31 0 top
R18  10K  [R0603]  38.17 87.61 0 top
R19  10K  [R0603]  45.1 78.81 270 top
R20  220  [R0603]  26.92 74.73 0 top
R21  5.1K  [R0603]  4.73 63.93 0 top
R22  5.1K  [R0603]  4.73 75.74 0 top
R23  10K  [R0603]  24.51 44.12 0 top
R24  10K  [R0603]  11.3 94.85 90 top
R25  10k  [R0603]  46.1 49.45 90 top
SW1  TS-1088-AR02016  [SW-SMD_L3.9-W3.0-P4.45]  50.29 70.03 270 top
SW2  TS-1088-AR02016  [SW-SMD_L3.9-W3.0-P4.45]  50.21 62.99 270 top
SW3  TS-1088-AR02016  [SW-SMD_L3.9-W3.0-P4.45]  50.22 55.92 270 top
SW4  TS-1088-AR02016  [SW-SMD_L3.9-W3.0-P4.45]  16.56 41.87 90 top
U2  1N5819WS  [SOD-323_L1.8-W1.3-LS2.5-RD]  16.47 57.82 180 top
U3  MCP73831T-2ACI/OT  [SOT-23-5_L3.0-W1.7-P0.95-LS2.8-BL]  7.11 53.01 0 top
U5  1N5819WS  [SOD-323_L1.8-W1.3-LS2.5-RD]  20.64 46.91 0 top
U6  1N5819WS  [SOD-323_L1.8-W1.3-LS2.5-RD]  20.64 44.15 0 top
U7  13.56MHz  [SO-8_L4.9-W3.9-P1.27-LS5.9-BL]  47.88 43.1 0 top
U12  -  [焊盘]  15.31 52.44 180 top
U13  -  [焊盘]  7.49 45.4 90 top
U14  STM32F411RET6  [LQFP-64_L10.0-W10.0-P0.50-LS12.0-BL]  18.54 71.42 90 top
U15  MSTPS7A2033PDBVR  [SOT-23-5_L3.0-W1.7-P0.95-LS2.8-BL]  31.24 52.63 270 top
U16  1625854-3  [TESTPOINT-SMD_L1.6-W0.8]  48.49 38.23 270 top
U17  1625854-3  [TESTPOINT-SMD_L1.6-W0.8]  47.09 38.23 90 top
USB1  TYPE-C 16PIN 2MD(073)  [USB-C-SMD_TYPE-C-16PIN-2MD-073]  3.94 69.9 270 top
X2  25MHz  [CRYSTAL-SMD_4P-L3.2-W2.5-BL]  27.81 69.65 90 top

## Footprints (pads in the part's own frame, mm; a bottom-side part is the same pattern mirrored in y, then rotated)
C0603
  rect 0.8x0.9 smd: 1(-0.7,0) 2(0.7,0)
CRYSTAL-SMD_4P-L3.2-W2.5-BL
  rect 1.4x1.2 smd: 1(-1.1,-0.85) 2(1.1,-0.85) 3(1.1,0.85) 4(-1.1,0.85)
FPC-SMD_18P-P0.50_FPC-05F-18PH20
  rect 0.3x1.25 smd: 1(-4.25,1.288) 2(-3.75,1.288) 3(-3.25,1.288) 4(-2.75,1.288) 5(-2.25,1.288) 6(-1.75,1.288) 7(-1.25,1.288) 8(-0.75,1.288) 9(-0.25,1.288) 10(0.25,1.288) 11(0.75,1.288) 12(1.25,1.288) 13(1.75,1.288) 14(2.25,1.288) 15(2.75,1.288) 16(3.25,1.288) 17(3.75,1.288) 18(4.25,1.288)
  rect 2x2.5 smd: 19(-5.94,-1.288) 20(5.94,-1.252)
HDR-TH_3P-P2.54-V-M_PZ254V-11-03P
  rect 1.7x1.7 hole 1.02: 1(-2.54,0)
  round 1.7 hole 1.02: 2(0,0) 3(2.54,0)
HDR-TH_4P-P2.54-V-M
  rect 1.7x1.7 hole 1.1: 1(-3.81,0)
  round 1.7 hole 1.1: 2(-1.27,0) 3(1.27,0) 4(3.81,0)
HDR-TH_8P-P2.54-V-M
  rect 1.5x1.5 hole 1: 1(-8.89,0)
  round 1.5 hole 1: 2(-6.35,0) 3(-3.81,0) 4(-1.27,0) 5(1.27,0) 6(3.81,0) 7(6.35,0) 8(8.89,0)
L0603
  rect 0.8x0.864 smd: 1(-0.7,0) 2(0.7,0)
LED_0603
  rect 0.8x0.8 smd: 1(-0.851,-0.01) 2(0.75,-0.005)
LQFP-64_L10.0-W10.0-P0.50-LS12.0-BL
  oval 0.3x1.5 smd: 1(-3.75,-5.688) 2(-3.25,-5.688) 3(-2.75,-5.688) 4(-2.25,-5.688) 5(-1.75,-5.688) 6(-1.25,-5.688) 7(-0.75,-5.688) 8(-0.25,-5.688) 9(0.25,-5.688) 10(0.75,-5.688) 11(1.25,-5.688) 12(1.75,-5.688) 13(2.25,-5.688) 14(2.75,-5.688) 15(3.25,-5.688) 16(3.75,-5.688) 33(3.75,5.688) 34(3.25,5.688) 35(2.75,5.688) 36(2.25,5.688) 37(1.75,5.688) 38(1.25,5.688) 39(0.75,5.688) 40(0.25,5.688) 41(-0.25,5.688) 42(-0.75,5.688) 43(-1.25,5.688) 44(-1.75,5.688) 45(-2.25,5.688) 46(-2.75,5.688) 47(-3.25,5.688) 48(-3.75,5.688)
  oval 1.5x0.3 smd: 17(5.7,-3.738) 18(5.7,-3.238) 19(5.7,-2.738) 20(5.7,-2.238) 21(5.7,-1.738) 22(5.7,-1.238) 23(5.7,-0.739) 24(5.7,-0.238) 25(5.7,0.262) 26(5.7,0.762) 27(5.7,1.262) 28(5.7,1.762) 29(5.7,2.261) 30(5.7,2.762) 31(5.7,3.261) 32(5.7,3.762) 49(-5.7,3.762) 50(-5.7,3.261) 51(-5.7,2.762) 52(-5.7,2.261) 53(-5.7,1.762) 54(-5.7,1.262) 55(-5.7,0.762) 56(-5.7,0.262) 57(-5.7,-0.238) 58(-5.7,-0.739) 59(-5.7,-1.238) 60(-5.7,-1.738) 61(-5.7,-2.238) 62(-5.7,-2.738) 63(-5.7,-3.238) 64(-5.7,-3.738)
R0603
  rect 0.806x0.864 smd: 1(-0.753,0) 2(0.753,0)
R0805
  rect 1.133x1.377 smd: 1(-1,0) 2(1,0)
SO-8_L4.9-W3.9-P1.27-LS5.9-BL
  oval 0.574x1.888 smd: 1(-1.905,-2.699) 2(-0.635,-2.699) 3(0.635,-2.699) 4(1.905,-2.699) 5(1.905,2.699) 6(0.635,2.699) 7(-0.635,2.699) 8(-1.905,2.699)
SOD-123_L2.7-W1.6-LS3.7-FD
  rect 0.88x0.96 smd: 1(-1.61,0) 2(1.61,0)
SOD-323_L1.8-W1.3-LS2.5-RD
  rect 1x0.7 smd: 1(-1.173,0) 2(1.173,0)
SOT-23-3_L2.9-W1.3-P1.90-LS2.4-BR
  rect 1.25x0.7 smd: 1(1,-0.95) 2(1,0.95) 3(-1,0)
SOT-23-5_L3.0-W1.7-P0.95-LS2.8-BL
  rect 0.49x1.157 smd: 1(-0.95,-1.153) 2(0,-1.153) 3(0.95,-1.153)
  rect 0.49x1.175 smd: 4(0.95,1.153) 5(-0.95,1.153)
SOT-23_L2.9-W1.3-P1.90-LS2.4-BR
  rect 1x0.8 smd: 1(1.15,-0.95) 2(1.15,0.95) 3(-1.15,0)
SW-SMD_L3.9-W3.0-P4.45
  rect 1.23x1.86 smd: 1(-2.185,0) 2(2.185,0)
TESTPOINT-SMD_L1.6-W0.8
  rect 1.6x0.8 smd: 1(0,0)
TF-SMD_TF-01A
  rect 0.6x1.3 smd: 1(2.24,5.276) 2(1.14,5.276) 3(0.04,5.276) 4(-1.06,5.276) 5(-2.16,5.276) 6(-3.26,5.276) 7(-4.36,5.276) 8(-5.46,5.276) 9(-6.56,5.276)
  rect 1.2x1.4 smd: 10(-7.76,4.426) 13(6.92,4.426)
  rect 1.2x2 smd: 11(-7.76,-5.276) 12(7.76,-5.276)
USB-C-SMD_TYPE-C-16PIN-2MD-073
  oval 1.1x2 hole 0.6x1.5: 13(-4.325,1.825) 14(4.325,1.825)
  oval 1.2x1.8 hole 0.6x1.2: 13(-4.325,-2.375) 14(4.325,-2.375)
  rect 0.55x1.1 smd: A1B12(-3.2,2.375) A4B9(-2.4,2.375) B1A12(3.2,2.375) B4A9(2.4,2.375)
  rect 0.3x1.1 smd: A5(-1.25,2.375) A6(-0.25,2.375) A7(0.25,2.375) A8(1.25,2.375) B5(1.75,2.375) B6(0.75,2.375) B7(-0.75,2.375) B8(-1.75,2.375)
焊盘
  round 5 smd: 1(0,0)

## Nets
As in the schematic.

Pads without a net: FPC1 15 16 17 18 19 20; U14 2 3 4 8 9 10 11 17 29 33 50 55 61 62; U15 4; USB1 A8 B8

## Via types
v1: diameter 0.61, hole 0.305, Top Layer to Bottom Layer, 184 vias

## Routing (per net, layer and track width the routed paths; a pad name or vN(x,y) marks a point on that pad's centre or on a via; arc(x,y) is an arc through that point)
+5V:
  vias: v1(5.65,60) v1(5.83,57.96) v1(6.31,72.3) v1(6.31,67.5) v1(8,59.98) v1(10.22,63.81) v1(10.22,61.65) v1(35.14,42.72)
GND: length 67.1
  Top Layer w0.152: v1(25.55,71.42) v1(25.55,72.65) v1(26.68,72.65) v1(27.8,72.65) v1(28.93,72.65) v1(30.05,72.65) v1(31.18,72.65) v1(32.41,72.65) v1(32.41,71.69) v1(32.41,70.73) v1(32.41,69.77) v1(32.41,68.81) v1(32.41,67.85) v1(32.41,66.89) v1(31.25,66.89) v1(30.09,66.89) v1(28.94,66.89) v1(27.78,66.89) v1(26.62,66.89) v1(25.59,66.89) v1(25.59,67.91) v1(25.59,69)
  Top Layer w0.32: U7.4 50.71,40.41 v1(50.8,40.31) ; v1(26.62,66.89) 26.96,67.23 X2.4 ; U14.12 25.3,73.17 25.55,72.93 v1(25.55,72.65) ; USB1.B1A12 6.31,66.13 USB1.14 5.46,65.28 v1(5.46,63.93) R21.2 ; U15.2 v1(31.36,52.63) ; v1(11.62,66.09) v1(11.62,63.81) v1(11.62,61.65) ; U14.63 21.82,65.76 21.82,66.52 21.87,66.57 v1(21.87,66.77) ; H4.1 8.86,93.02 v1(7.11,93.02) ; 28.66,70.75 29.64,69.77 v1(32.41,69.77) ; v1(6.31,73.1) 6.31,73.68 USB1.13 ; v1(7.11,82.09) 8.76,82.09 H2.1 ; v1(29.78,97.21) FPC1.1 ; U14.47 v1(14.08,68.17) ; v1(23.18,78.92) 23.18,76.32 22.93,76.06 22.09,76.06 21.78,76.37 U14.18 ; v1(14.86,75.87) 15.28,76.29 U14.31 ; v1(33.66,72.69) 33.61,72.65 v1(32.41,72.65) ; FPC1.8 26.29,95.55 v1(26.29,97.21) ; USB1.13 USB1.14
  vias: v1(4.25,60) v1(4.32,52.6) v1(5.53,75.74) v1(6.35,46.15) v1(6.38,45.4) v1(6.38,44.61) v1(7.11,51.86) v1(7.49,46.15) v1(7.49,45.4) v1(7.49,44.61) v1(8.69,46.15) v1(8.69,45.4) v1(8.73,44.61) v1(10.67,53.58) v1(11.41,88.34) v1(13.64,42.56) v1(13.78,80.63) v1(15.75,80.63) v1(16.19,59.74) v1(16.56,39.68) v1(21.68,93.9) v1(21.78,91.92) v1(21.78,89.84) v1(23.69,63.93) v1(25.14,58.48) v1(27.42,58.35) v1(27.4,54.97) v1(29.57,47.86) v1(33.39,39.93) v1(34.94,61.2) v1(34.94,58.75) v1(36.34,54.05) v1(36.34,51.6) v1(38.73,45.85) v1(40.71,84.44) v1(41.56,94.62) v1(41.56,79.94) v1(42.23,40.18) v1(42.94,79.51) v1(47.34,69.42) v1(47.35,62.31) v1(47.36,55.19) v1(50.2,72.24) v1(50.21,65.17) v1(50.22,58.11) v1(51.26,95.46) v1(51.26,79.94)
VBAT: length 1
  Top Layer w0.32: U14.1 24.76,67.14 v1(24.76,66.85)
  vias: v1(17.59,59.74) v1(17.64,57.82)
VDDA: length 12.1
  Top Layer w0.32: U14.13 36.29,73.67 v1(36.3,73.69)
  vias: v1(36.34,61.2) v1(36.34,58.75) v1(36.32,56.4)
BAT:
  vias: v1(19.42,52.5) v1(25.12,53.52) v1(27.4,53.57) v1(30.09,53.58) v1(30.09,51.68)
BAT_CHG_DET: length 26.2
  Top Layer w0.152: R2.2 2.07,52.01 2.23,51.86 U3.1 6.16,52.82 6.41,53.07 8.7,53.07 9.27,53.64 9.27,56.06 14.73,61.52 16.76,61.52 18.28,63.04 U14.56
BAT_DET: length 26.3
  Top Layer w0.152: 25.12,56.92 25.02,56.82 v1(23.37,56.82) ; 25.12,56.92 R6.1 ; 25.12,56.92 R7.2 27.4,56.93 C26.1 ; v1(21.68,70.79) 21.68,73.12 22.73,74.17 U14.14
  Bottom Layer w0.152: v1(23.37,56.82) 21.34,58.85 21.34,70.45 v1(21.68,70.79)
BAT_IN:
  vias: v1(8.06,51.86) v1(10.67,52.18) v1(14.1,53.77) v1(14.1,52.5) v1(14.1,51.23) v1(15.3,57.82) v1(15.31,53.77) v1(15.31,52.5) v1(15.31,51.23) v1(16.47,53.77) v1(16.47,52.5) v1(16.47,51.23) v1(20.2,49.33) v1(21.72,53.45)
BOOT0: length 36.2
  Top Layer w0.152: U14.60 20.32,65.77 v1(20.32,68.38) ; R24.1 12.76,94.1 13.34,93.52 13.34,81.36 13.1,81.13 13.1,78.74 13.34,78.51 13.34,76.38 15.11,74.6 v1(15.11,68.38)
  Bottom Layer w0.152: v1(15.11,68.38) v1(20.32,68.38)
BUTTON_1: length 42.9
  Top Layer w0.152: SW2.2 45.5,60.8 R10.1 41.87,60.92 41.15,61.65 41.15,63.93 39.24,65.84 24.26,65.84 19.81,70.28 19.81,75.11 18.8,76.12 18.8,77.11 U14.24
BUTTON_2: length 50.1
  Top Layer w0.152: U14.25 18.29,77.12 18.29,76 19.43,74.85 19.43,70.03 24.13,65.33 38.99,65.33 40.64,63.68 40.64,55.3 42.16,53.77 45.33,53.77 R11.1 45.45,53.74 SW3.2
EC_KEY: length 8.7
  Top Layer w0.152: C36.2 16.47,43.97 SW4.2 19.37,44.05 U6.1 U5.1
EC_KEY_DET: length 38.4
  Top Layer w0.152: v1(23.75,45.52) 23.75,44.13 23.73,44.15 21.81,44.15 ; U14.28 16.76,77.11 16.76,76 17.15,75.62 18.03,75.62 18.41,75.23 v1(18.41,67.84)
  Top Layer w0.32: 23.75,44.13 R23.1
  Bottom Layer w0.152: v1(23.75,45.52) 23.75,53.39 18.41,58.72 v1(18.41,67.84)
JTMS-SWCLK: length 24.2
  Top Layer w0.152: v1(9.81,80.7) 9.87,80.76 9.87,83.01 9.74,83.14 8.99,83.14 8.79,83.33 H2.2 ; U14.49 14.76,65.71 v1(13.19,65.71)
  Bottom Layer w0.152: v1(13.19,65.71) 13.21,65.73 13.21,66.47 12.57,67.11 10.29,67.11 9.81,67.58 v1(9.81,80.7)
JTMS-SWDIO: length 22.2
  Top Layer w0.152: U14.46 11.47,68.67 11.42,68.62 v1(10.41,68.62) ; v1(10.41,86.41) 10.29,86.41 9.56,87.14 H2.3
  Bottom Layer w0.152: v1(10.41,86.41) v1(10.41,68.62)
K: length 3.2
  Top Layer w0.254: FPC1.11 FPC1.12 FPC1.13 FPC1.14 23.23,95.49 R13.1
LCD_CS: length 23.5
  Top Layer w0.152: U14.20 20.78,85.6 21.84,86.67 25.53,86.67 27.78,88.92 FPC1.5
LCD_DC: length 27.3
  Top Layer w0.152: FPC1.4 28.28,90.05 ; U14.26 17.78,87.3 19.18,88.7 24.68,88.7 v1(26.03,90.05)
  Bottom Layer w0.152: v1(28.31,90.05) v1(26.03,90.05)
LCD_MISO: length 24.1
  Top Layer w0.152: FPC1.7 26.78,89.31 25.53,88.06 20.83,88.06 19.78,87.01 U14.22
LCD_MOSI: length 25.1
  Top Layer w0.152: v1(19.25,86.92) 19.28,86.89 U14.23 ; FPC1.6 27.28,89.18 25.53,87.43 21.08,87.43 v1(20.57,86.92)
  Bottom Layer w0.152: v1(19.25,86.92) v1(20.57,86.92)
LCD_RST: length 28
  Top Layer w0.152: FPC1.2 29.28,88.51 25.91,85.14 22.35,85.14 21.46,84.25 v1(21.46,81.33) ; U14.27 17.27,77.13 17.27,80.57 17.25,80.59 v1(17.25,81.33)
  Bottom Layer w0.152: v1(17.25,81.33) v1(21.46,81.33)
LCD_SCK: length 25.3
  Top Layer w0.152: v1(20.31,85.89) 20.31,77.16 U14.21 ; v1(21.84,85.91) 25.91,85.91 28.96,88.95 28.96,90.35 28.78,90.53 FPC1.3
  Bottom Layer w0.152: v1(21.84,85.91) 21.82,85.89 v1(20.31,85.89)
LED: length 2
  Top Layer w0.152: U14.15 26.12,74.67 R20.1
MCU_3.3: length 18.5
  Top Layer w0.32: v1(25.27,92.63) 25.28,92.64 FPC1.10 ; H2.4 11.36,89.68 v1(11.41,89.74) ; U14.19 21.28,78.42 v1(21.78,78.92) ; U14.48 10.6,67.67 10.29,67.36 10.29,66.16 v1(10.22,66.09) ; H4.3 v1(11.18,98.09) ; C22.2 22.33,63.93 v1(22.34,63.94) 22.34,65.67 U14.64 ; U14.32 14.78,78.23 v1(13.78,79.23) ; 25.52,95.54 FPC1.9
  vias: v1(23.18,91.92) v1(23.18,89.84) v1(25.26,44.12) v1(26.14,76.53) v1(32.4,53.58) v1(34.92,56.4) v1(34.94,54.05) v1(34.94,51.6) v1(37.37,93.02) v1(37.37,90.32) v1(37.41,87.7) v1(37.37,84.9) v1(37.41,82.19) v1(38.73,44.45) v1(40.71,86.64) v1(42.94,78.11) v1(45.1,78.01) v1(45.35,69.55) v1(45.38,62.43) v1(45.38,55.32) v1(46.04,50.26) v1(45.97,45.8) v1(48.53,50.25) v1(50.92,50.17)
PA8: length 19.4
  Top Layer w0.152: U14.41 9.78,71.17 8.76,72.19 8.76,76.75 2.54,82.97 2.54,84.12 2.29,84.38
PA9: length 18
  Top Layer w0.152: H5.2 2.92,81.84 8.25,76.5 8.25,71.68 9.26,70.67 U14.42
PA10: length 17.2
  Top Layer w0.152: U14.43 8.87,70.17 7.75,71.3 7.75,76.25 4.7,79.3 2.29,79.3
PB13: length 28.4
  Top Layer w0.152: 2.29,97.08 3.68,97.08 5.59,95.17 5.59,82.86 10.54,77.9 10.54,75.62 11.48,74.67 U14.34
PB14: length 26.3
  Top Layer w0.152: 2.29,94.54 3.43,94.54 5.08,92.89 5.08,82.86 10.16,77.78 10.16,75.36 11.35,74.17 U14.35
PB15: length 24.3
  Top Layer w0.152: U14.36 12.73,73.8 10.84,73.8 9.91,74.73 9.91,77.52 4.57,82.86 4.57,90.47 3.05,92 H5.6
PC6: length 22.3
  Top Layer w0.152: 2.29,89.46 2.92,89.46 4.06,88.32 4.06,82.73 9.65,77.14 9.65,74.22 10.57,73.3 12.73,73.3 U14.37
PC7: length 20.5
  Top Layer w0.152: H5.4 2.79,86.92 3.43,86.28 3.43,82.73 9.4,76.76 9.4,73.46 10.14,72.71 12.81,72.71 U14.38
PWR_EN: length 42.7
  Top Layer w0.152: v1(35.18,47.93) 35.18,46.07 D4.2 ; v1(20.96,71.81) 20.96,73.84 22.29,75.17 U14.16
  Bottom Layer w0.152: v1(35.18,47.93) 35.18,48.95 33.78,50.34 25.02,50.34 24.26,51.11 24.26,53.9 20.96,57.2 v1(20.96,71.81)
RCC_OSC_IN: length 7.9
  Top Layer w0.152: 31.03,68.41 30.89,68.55 28.66,68.55 28.7,68.59 28.7,69.52 28.55,69.67 U14.5
RCC_OSC_OUT: length 9.2
  Top Layer w0.152: U14.6 25.42,70.17 25.91,70.66 26.88,70.66 X2.3 26.96,71.82 27.12,71.97 30.88,71.97 31.03,71.82 31.03,70.83
RST: length 33.2
  Top Layer w0.152: SW1.2 45.55,67.84 45.35,68.04 45.35,67 44.58,66.22 24.51,66.22 23.11,67.61 23.11,70.4 23.39,70.67 U14.7
SDIO_CK: length 46
  Top Layer w0.152: 40.71,85.54 40.72,85.52 v1(42.04,85.52) ; v1(17.15,74.73) 16.78,74.36 U14.53
  Bottom Layer w0.152: v1(42.04,85.52) 42.04,86.28 41.15,87.17 35.56,87.17 31.62,83.24 31.62,75.74 30.61,74.73 v1(17.15,74.73)
SDIO_CMD: length 42.5
  Top Layer w0.152: v1(17.68,74.12) 17.16,73.6 17.16,65.85 U14.54 ; 40.71,87.74 40.58,87.61 39.04,87.61 39,87.57 38.96,87.61 R18.2 38.99,87.54 v1(38.99,86.28)
  Bottom Layer w0.152: v1(38.99,86.28) 35.81,86.28 32.13,82.6 32.13,75.36 30.89,74.12 v1(17.68,74.12)
SDIO_D0: length 38.6
  Top Layer w0.152: v1(14.36,73.58) 13.83,73.05 13.83,72.52 13.49,72.17 U14.39 ; R14.2 38.92,83.69 39.37,83.24 40.61,83.24 40.71,83.34
  Bottom Layer w0.152: v1(38.96,83.6) 34.14,83.6 32.64,82.09 32.64,74.85 31.37,73.58 v1(14.36,73.58)
SDIO_D1: length 36.4
  Top Layer w0.152: U14.40 14.47,71.67 v1(14.48,71.68) ; 40.71,82.24 40.66,82.19 R15.2 v1(38.92,80.92)
  Bottom Layer w0.152: v1(14.48,71.68) 15.11,71.68 16.64,73.2 32,73.2 33.15,74.35 33.15,80.19 33.88,80.92 v1(38.92,80.92)
SDIO_D2: length 51.4
  Top Layer w0.152: 40.71,89.94 40.77,89.99 40.77,92.63 40.38,93.02 39.03,93.02 39,92.98 38.96,93.02 R16.2 38.99,92.95 v1(38.99,91.62) ; v1(15.78,75.92) 15.78,65.73 U14.51
  Bottom Layer w0.152: v1(38.99,91.62) 35.31,91.62 29.84,86.16 29.84,77.14 28.62,75.92 v1(15.78,75.92)
SDIO_D3: length 45.5
  Top Layer w0.152: U14.52 16.39,65.83 v1(16.39,75.36) ; R17.2 38.99,90.25 v1(38.99,88.94) 40.6,88.94 40.71,88.84
  Bottom Layer w0.152: v1(38.99,88.94) 36.06,88.94 30.99,83.87 30.99,76.25 30.1,75.36 v1(16.39,75.36)
ST25_GPO: length 44.1
  Top Layer w0.152: U14.57 18.8,65.71 18.8,63.17 20.07,61.9 37.59,61.9 37.97,61.52 37.97,54.03 43.3,48.7 R25.1 46.85,48.7 47.12,48.44 47.12,45.93 U7.7
ST25_I2C_SCL: length 44.9
  Top Layer w0.152: U7.6 R8.2 48.51,49.18 48.36,49.33 43.68,49.33 38.48,54.53 38.48,61.65 37.85,62.28 20.57,62.28 19.28,63.57 U14.58
ST25_I2C_SDA: length 50.8
  Top Layer w0.152: U7.5 49.78,48.31 50.17,48.7 R9.2 ; R9.2 50.92,48.69 50.93,48.69 ; R9.2 50.93,48.69 ; 19.78,65.85 19.78,64.09 21.08,62.79 38.23,62.79 39.37,61.65 39.37,54.79 42.8,51.36 51.69,51.36 52.07,50.98 52.07,49.07 51.69,48.69 50.93,48.69 ; 50.93,48.69 50.93,48.44
USB_OTG_FS_DM: length 9.1
  Top Layer w0.152: 6.99,69.65 7.24,69.9 7.24,70.54 7.11,70.66 6.32,70.66 USB1.B7 ; 6.99,69.65 USB1.A7 ; 6.99,69.65 6.99,69.65 7.37,69.65 7.49,69.77 7.87,69.77 8,69.65 8.25,69.65 8.41,69.8 8.8,69.8 9,69.6 9.22,69.6 9.4,69.77 9.78,69.77 9.91,69.65 10.16,69.65 10.29,69.77 10.67,69.77 10.75,69.69 11.09,69.69 11.18,69.77 11.56,69.77 11.66,69.67 U14.44
USB_OTG_FS_DP: length 9.1
  Top Layer w0.152: USB1.A6 6.31,70.16 5.59,70.16 5.46,70.03 5.46,69.27 5.58,69.15 USB1.B6 6.34,69.17 U14.45
WIRE: length 1372.4
  Top Layer w0.32: v1(44.32,26.47) 44.32,10.08 43.43,9.19 10.54,9.19 9.65,10.08 9.65,27.23 10.54,28.12 44.2,28.12 45.21,27.1 45.21,9.32 44.32,8.43 9.65,8.43 8.76,9.32 8.76,28.12 9.65,29.01 45.09,29.01 46.1,27.99 46.1,8.56 45.21,7.67 8.89,7.67 8,8.56 8,29.01 8.89,29.9 45.97,29.9 46.99,28.88 46.99,7.67 46.1,6.78 8.25,6.78 7.24,7.8 7.24,29.9 8.13,30.78 46.86,30.78 47.88,29.77 47.88,6.78 46.99,5.89 7.37,5.89 6.35,6.91 6.35,30.78 7.24,31.67 47.75,31.67 48.77,30.66 48.77,6.02 47.77,5.02 6.59,5.02 5.46,6.15 5.46,31.55 6.48,32.56 48.64,32.56 49.66,31.55 49.66,5 48.77,4.12 5.9,4.12 4.7,5.31 4.7,32.44 5.72,33.45 49.53,33.45 50.55,32.44 50.55,4.12 49.53,3.1 5.21,3.1 3.81,4.5 3.81,33.33 4.83,34.34 50.29,34.34 51.37,33.27 51.37,3.16 50.42,2.21 4.57,2.21 2.92,3.86 2.92,34.21 3.94,35.23 51.05,35.23 52.2,34.09 52.2,2.21 51.18,1.19 4.3,1.19 2.03,3.46 2.03,34.72 3.43,36.12 46.86,36.12 47.24,36.5 U7.2 ; v1(48.51,35.99) U7.3
  Bottom Layer w0.32: v1(48.51,35.99) 48.51,30.66 v1(44.32,26.47)
$1N1186: length 5.5
  Top Layer w0.152: 2.07,54.12 2.07,57.07 2.95,57.95 LED3.1
$1N1187: length 1.9
  Top Layer w0.152: R3.1 6.14,54.14 U3.5
$1N1206: length 3.8
  Top Layer w0.152: F1.2 8.06,57.92 U3.4
$1N1217: length 8.4
  Top Layer w0.152: Q2.1 31.86,45.96 31.89,45.99 ; R4.2 31.89,45.99 ; 31.89,45.99 D4.1
$1N1218: length 10.5
  Top Layer w0.152: Q1.1 21.72,49.34 R5.1 21.81,49.23 21.81,46.91 27.57,46.91
$1N1953: length 6.1
  Top Layer w0.152: USB1.B5 4.73,68.15 3.98,67.4 R21.1
$1N1965: length 6.5
  Top Layer w0.152: R22.1 3.94,75.7 3.94,71.93 4.72,71.15 USB1.A5
$1N4078: length 1.8
  Top Layer w0.152: R20.2 27.68,76.47 LED2.1
$1N4684: length 2.5
  Top Layer w0.152: 11.3,95.6 11.25,95.55 H4.2
$1N7160: length 5.7
  Top Layer w0.152: CARD1.9 44.65,81.14 45.09,80.7 45.09,79.57 R19.1
$1N7661: length 2.4
  Top Layer w0.152: U7.1 45.75,40.18 C31.1
$1N12645: length 2.1
  Top Layer w0.152: C37.2 15.75,77.16 U14.30

## Copper pours and planes (outline as drawn; the poured copper is in the pictures)
+5V on Inner2: 5.72,72.69 6.98,72.69 6.98,71.82 5.38,71.82 5.38,68 9.14,68 9.14,64.95 10.64,64.95 10.64,60.8 8.92,60.8 8.92,59.27 4.99,59.27 4.95,59.23 4.95,61 6.98,61 6.98,67.09 5.59,67.09 5.59,67.43 5.01,67.43 4.95,67.49 4.95,72.23 5.38,72.23 5.59,72.44 5.59,72.57
+5V on Inner2: 34.67,43.23 35.69,43.23 35.69,37.39 1.78,37.39 1.78,50.5 4.95,50.5 4.95,60.96 6.47,60.96 6.47,55.8 5.72,55.04 5.72,48.71 4.08,48.71 3.43,48.06 3.43,39.8 4.73,38.41 34.67,38.41
GND on Inner1: 0,100 54,100 54,36.88 0,36.88
VBAT on Inner2: 24.42,60.45 24.42,64.95 23.52,64.95 23.52,67.97 23.5,68 25.17,68 25.17,59.5 18.44,59.5 18.44,57.21 18.32,57.09 16.93,57.09 16.89,57.13 16.89,60.45 16.89,60.45
VDDA on Inner2: 35.81,55.8 36.89,55.8 36.89,74.09 35.81,74.09
BAT on Inner2: 18.8,53.01 20.06,53.01 20.06,52.5 24.33,52.5 24.33,54.15 30.75,54.15 30.75,53.12 29.38,53.12 29.38,52.07 30.78,52.07 30.78,51.1 24.39,51.1 24.26,51.23 24.26,51.99 18.8,51.99
BAT_IN on Inner2: 11.94,52.63 7.75,52.63 7.75,51.23 12.55,51.23 12.55,49.52 18.54,49.52 18.54,48.33 20.97,48.33 20.97,50.2 20.96,50.22 18.5,50.22 18.45,53.39 21.03,53.39 21.03,52.88 22.42,52.88 22.42,54.06 18.41,54.06 18.41,55.57 16,55.57 16,58.34 14.56,58.34 14.56,55.59 12.27,55.59 12.27,52.97
MCU_3.3 on Inner2: 9.78,65.58 10.67,65.58 10.67,66.93 22.02,66.93 22.06,66.97 22.06,64.92 21.69,64.92 21.69,63.45 21.72,63.42 22.99,63.42 22.99,67.98 9.78,67.91
MCU_3.3 on Inner2: 21.21,66.98 21.21,67.49 22.99,67.49 22.99,68.45 20.75,68.45 20.7,68.5 20.7,67.72 19.79,67.72 19.79,67.01 19.81,66.98
MCU_3.3 on Inner2: 25.02,94.03 38.1,94.03 38.1,92.27 25.04,92.27 25.02,92.25
MCU_3.3 on Inner2: 22.04,66.86 22.04,75.94 22.1,76 22.1,77.38 21.09,78.39 21.09,79.92 21.96,79.92 22.1,79.93 22.35,79.93 22.35,78.28 22.99,77.65 22.97,66.86
MCU_3.3 on Inner2: 38.55,93.68 38.55,78.81 46.48,78.81 46.48,68.89 44.78,68.89 44.78,63.42 46.35,63.42 46.48,63.3 46.48,61.68 44.76,61.68 44.76,56.06 46.48,56.06 46.48,54.57 44.76,54.57 44.76,50.94 51.44,50.94 51.44,49.71 46.16,49.71 46.16,47.55 46.86,46.84 46.86,44.75 46.83,44.63 40.39,44.63 40.26,44.75 40.26,43.74 40,43.48 38.35,43.48 38.1,43.74 38.1,43.98 26.29,43.98 26.29,43.23 24.89,43.23 24.89,45.14 36.77,45.14 36.77,48.48 34.05,51.2 34.05,53.14 31.99,53.14 31.99,54.15 34.04,54.15 34.04,57.45 35.94,57.45 35.94,50.46 37.09,50.46 40.39,47.17 43.56,47.17 43.81,47.42 43.81,76.25 43.94,76.38 37.47,76.38 36.83,77.01 36.83,93.68
MCU_3.3 on Inner2: 40,86.92 40,86.28 42.49,86.28 42.49,93.9 40.62,93.9 40.62,95.27 36.45,95.27 36.45,92.19 38.18,92.19 38.18,93.69 40.09,93.69 41.4,92.38 41.4,87.05 40.13,87.05
MCU_3.3 on Inner2: 21.4,78.21 22.28,78.21 22.35,78.28 22.35,79.63 25.53,79.63 25.53,76 26.67,76 26.8,76.12 26.8,77.9 37.85,77.9 37.97,78.03 37.97,80.82 21.21,80.82 21.08,80.7 21.08,78.53
MCU_3.3 on Inner2: 7.62,99.23 17.9,99.23 18.03,99.37 18.03,93.32 24.99,93.32 25.03,96.41 26.16,96.41 26.16,90.86 24.38,89.08 22.61,89.08 22.61,92.5 12.32,92.5 12.32,89.04 10.12,89.04 9.53,88.44 7.62,88.44 7.62,90.86 10.65,90.86 11.56,91.77 11.56,93.02 12.45,93.9 12.45,96.57 12.06,96.95 7.62,96.95
MCU_3.3 on Inner2: 13.21,79.68 14.49,79.68 14.49,78.61 14.45,78.57 11.59,78.57 11.56,78.54 11.56,86.79 12.26,86.79 12.32,86.85 12.32,89.2 10.7,89.2 10.7,90.85 13.14,90.85 13.21,90.78

Small or netless copper shapes (teardrops, artwork), in the pictures only: 308 on Top Layer, 34 on Bottom Layer

## Text on the board
Top Silkscreen Layer: 20-40pF
